# EasyEDA schematic SCH_Macropad-rev2_2024-06-18.json
TITLE: Sheet_1; REV: 1.0; Date: 2024-06-18; Sheet: 1/1; Drawn By: elberto22; Company: Your Company
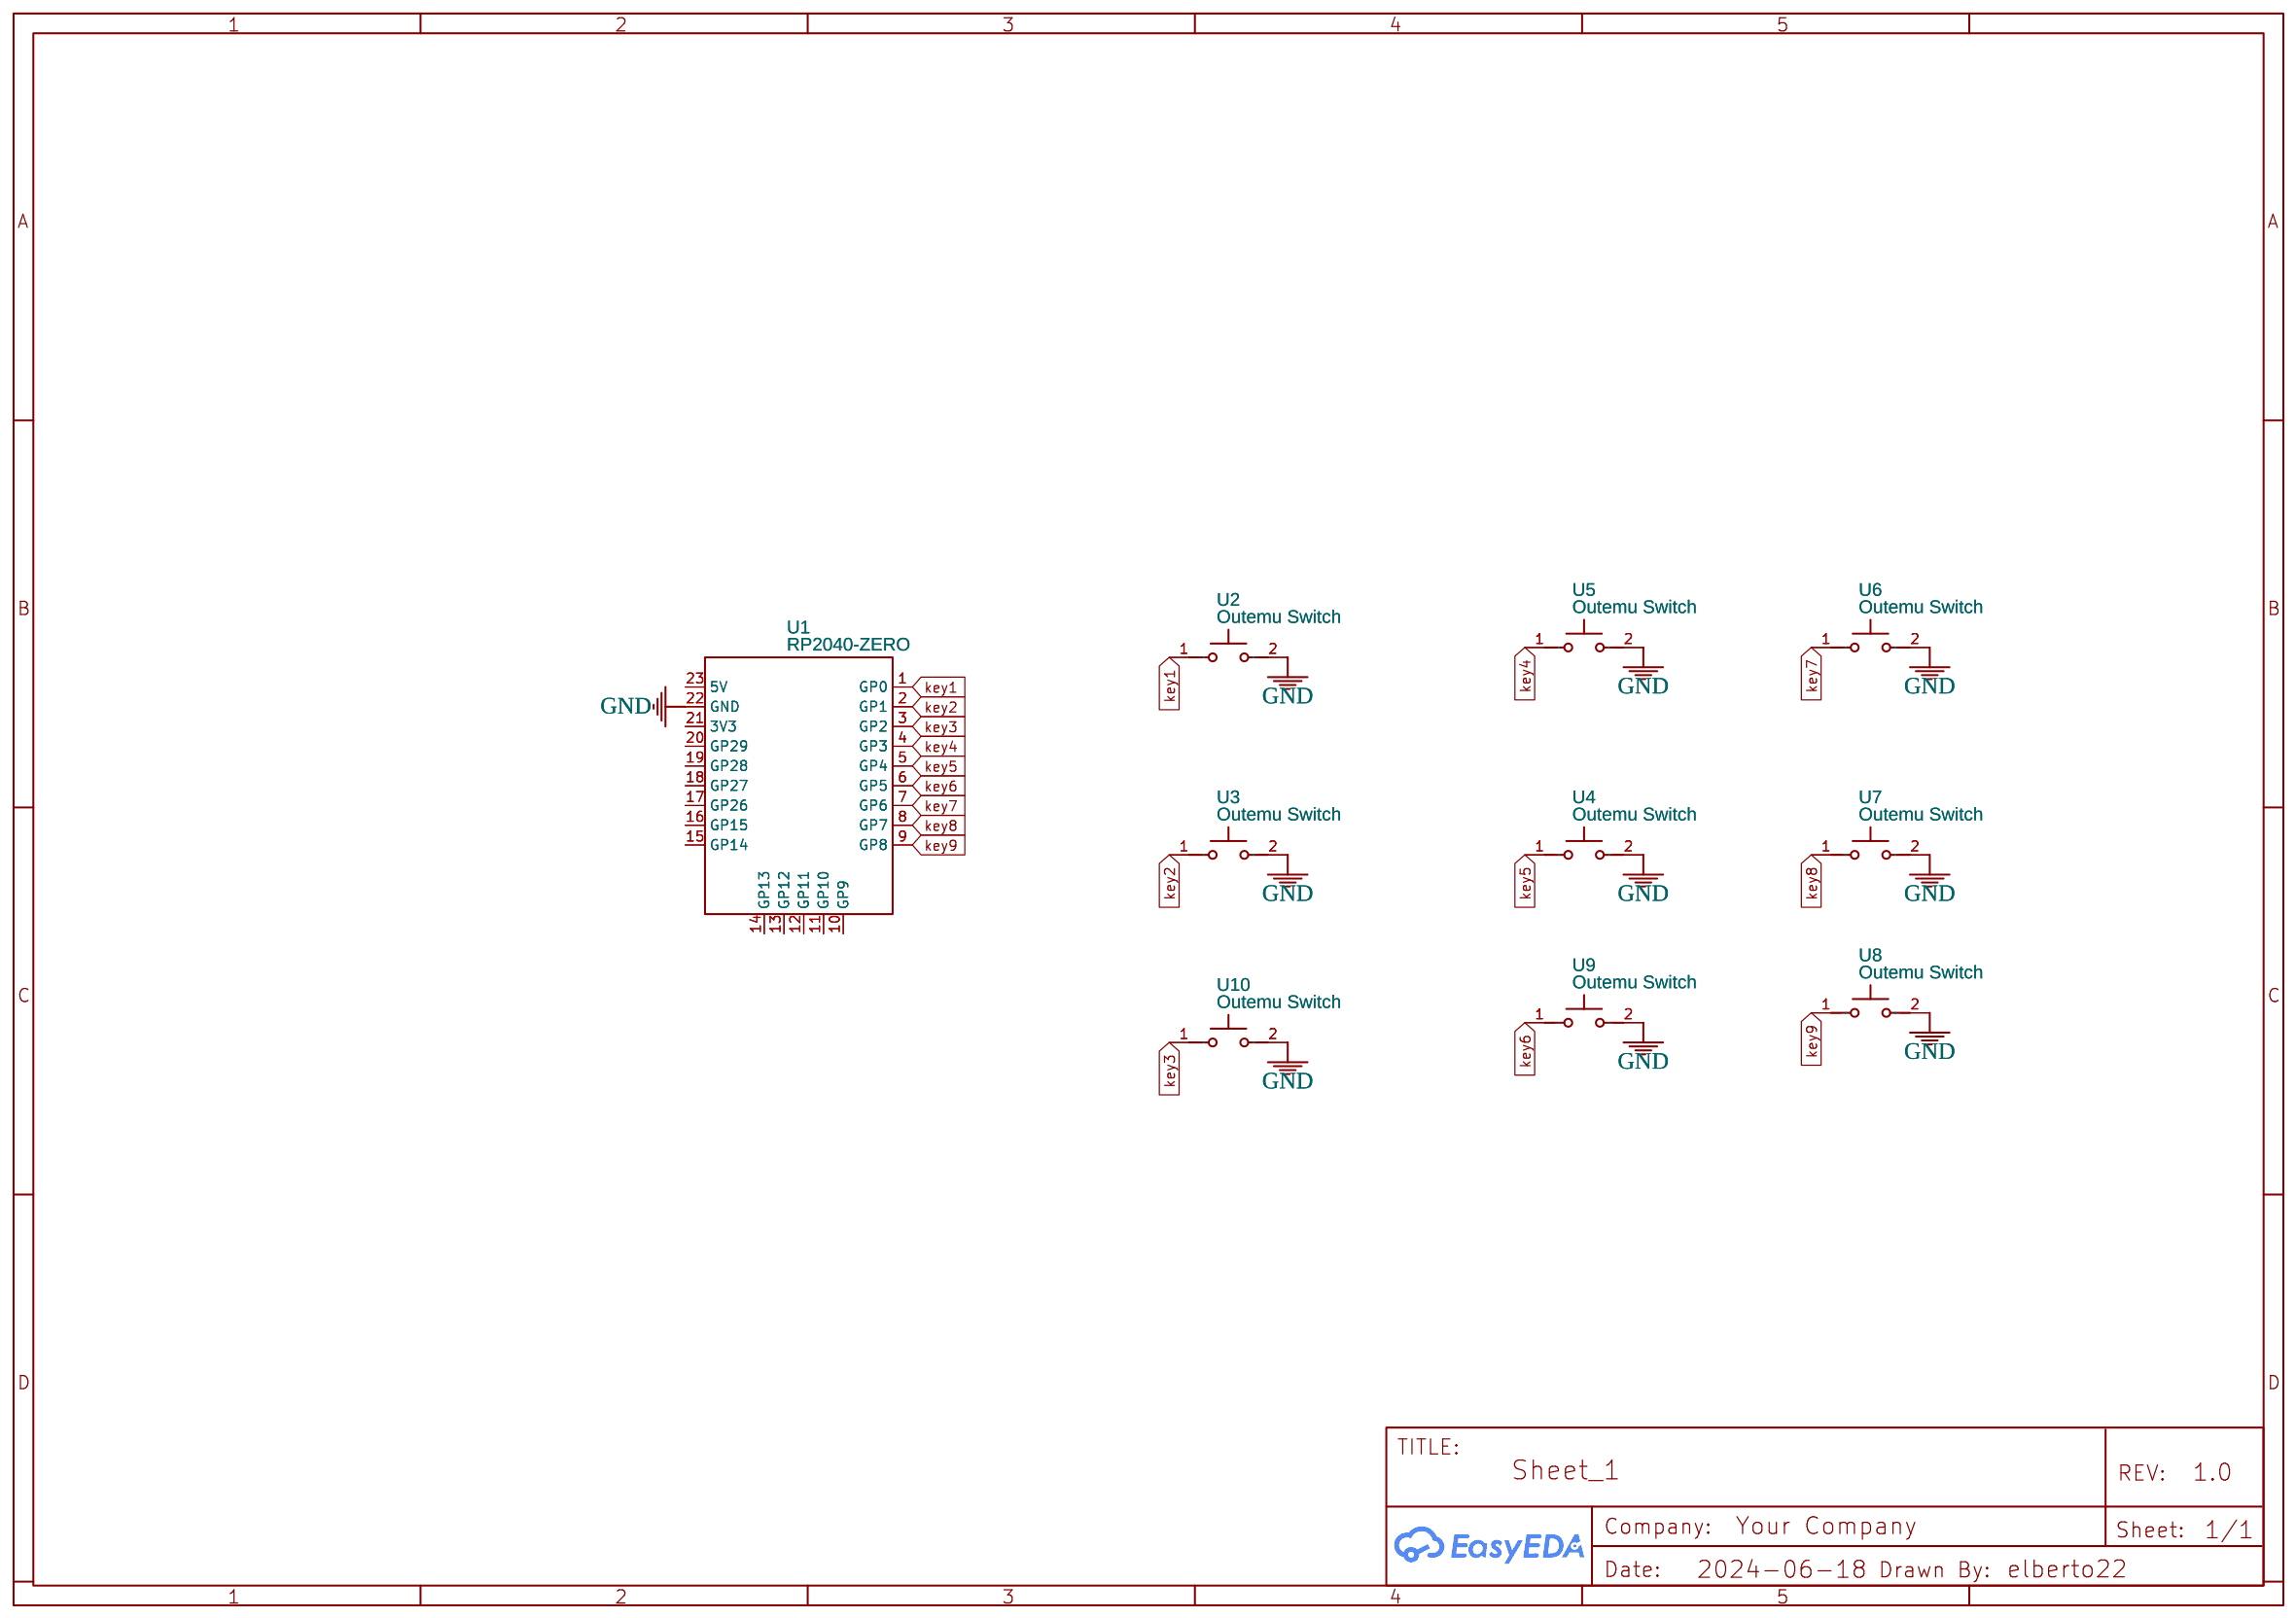
[diagram p0: schematic sheet]

## Parts
U1  RP2040-ZERO  [COMM-SMD_RP2040-ZERO]
U2  Outemu Switch  [OUTEMU SWITCH]
U3  Outemu Switch  [OUTEMU SWITCH]
U4  Outemu Switch  [OUTEMU SWITCH]
U5  Outemu Switch  [OUTEMU SWITCH]
U6  Outemu Switch  [OUTEMU SWITCH]
U7  Outemu Switch  [OUTEMU SWITCH]
U8  Outemu Switch  [OUTEMU SWITCH]
U9  Outemu Switch  [OUTEMU SWITCH]
U10  Outemu Switch  [OUTEMU SWITCH]

## Library data of the parts
U1 = RP2040-ZERO: Supplier: LCSC; Supplier Part: C5350143; Manufacturer: Waveshare(微雪电子); Manufacturer Part: RP2040-Zero; JLCPCB Part Class: Extended Part; Contributor: lcsc
U2-U10 = Outemu Switch: Manufacturer: HepLer; Supplier: Others; Contributor: QUEBO MTB

## Nets
GND: U1.22(GND) U2.2 U3.2 U4.2 U5.2 U6.2 U7.2 U8.2 U9.2 U10.2
key1: U1.1(GP0) U2.1
key2: U1.2(GP1) U3.1
key3: U1.3(GP2) U10.1
key4: U1.4(GP3) U5.1
key5: U1.5(GP4) U4.1
key6: U1.6(GP5) U9.1
key7: U1.7(GP6) U6.1
key8: U1.8(GP7) U7.1
key9: U1.9(GP8) U8.1

Not connected (* = marked no-connect by the designer): U1 10(GP9) 11(GP10) 12(GP11) 13(GP12) 14(GP13) 15(GP14) 16(GP15) 17(GP26) 18(GP27) 19(GP28) 20(GP29) 21(3V3) 23(5V)
